# Altium schematic sheet BTN.SchDoc
size A4
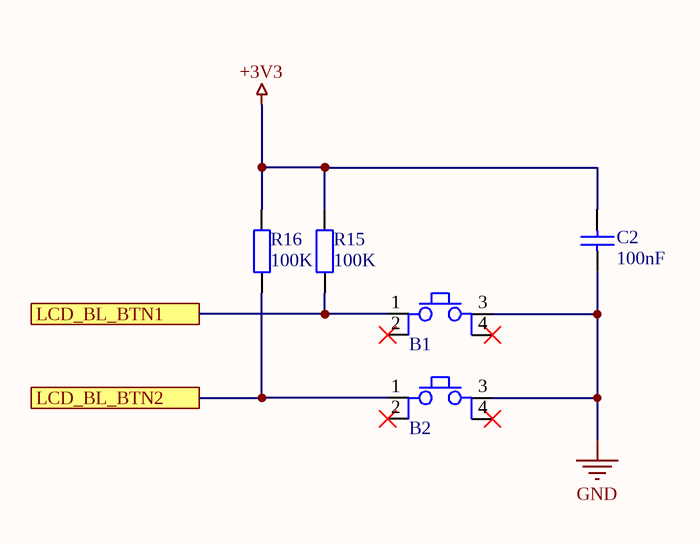
[diagram p0: BTN.SchDoc]

## Parts
B1  Button  [FSM4JSMA_AUT]  (value not drawn)
B2  Button  [FSM4JSMA_AUT]  (value not drawn)
C2  100nF  [FP_0805_CAP_085]
R15  100K  [FP_0805_RES]
R16  100K  [FP_0805_RES]

## Ports
LCD_BL_BTN1, LCD_BL_BTN2

## Nets
+3V3: C2.2 R15.2 R16.2
GND: B1.3 B2.3 C2.1
LCD_BL_BTN1: B1.1 R15.1 ; port LCD_BL_BTN1
LCD_BL_BTN2: B2.1 R16.1 ; port LCD_BL_BTN2

Not connected (* = marked no-connect by the designer): B1 2* 4*; B2 2* 4*

## Library data of the parts
B1 B2 = FSM4JSMA_AUT: Push button
C2 = 100nF_0805_CAP: Capacitor; Value: 100nF
R15 R16 = 100K_0805_RES: Resistor; Value: 100K